# EAGLE design thingSocketv0.1 (EAGLE 7.4.0)
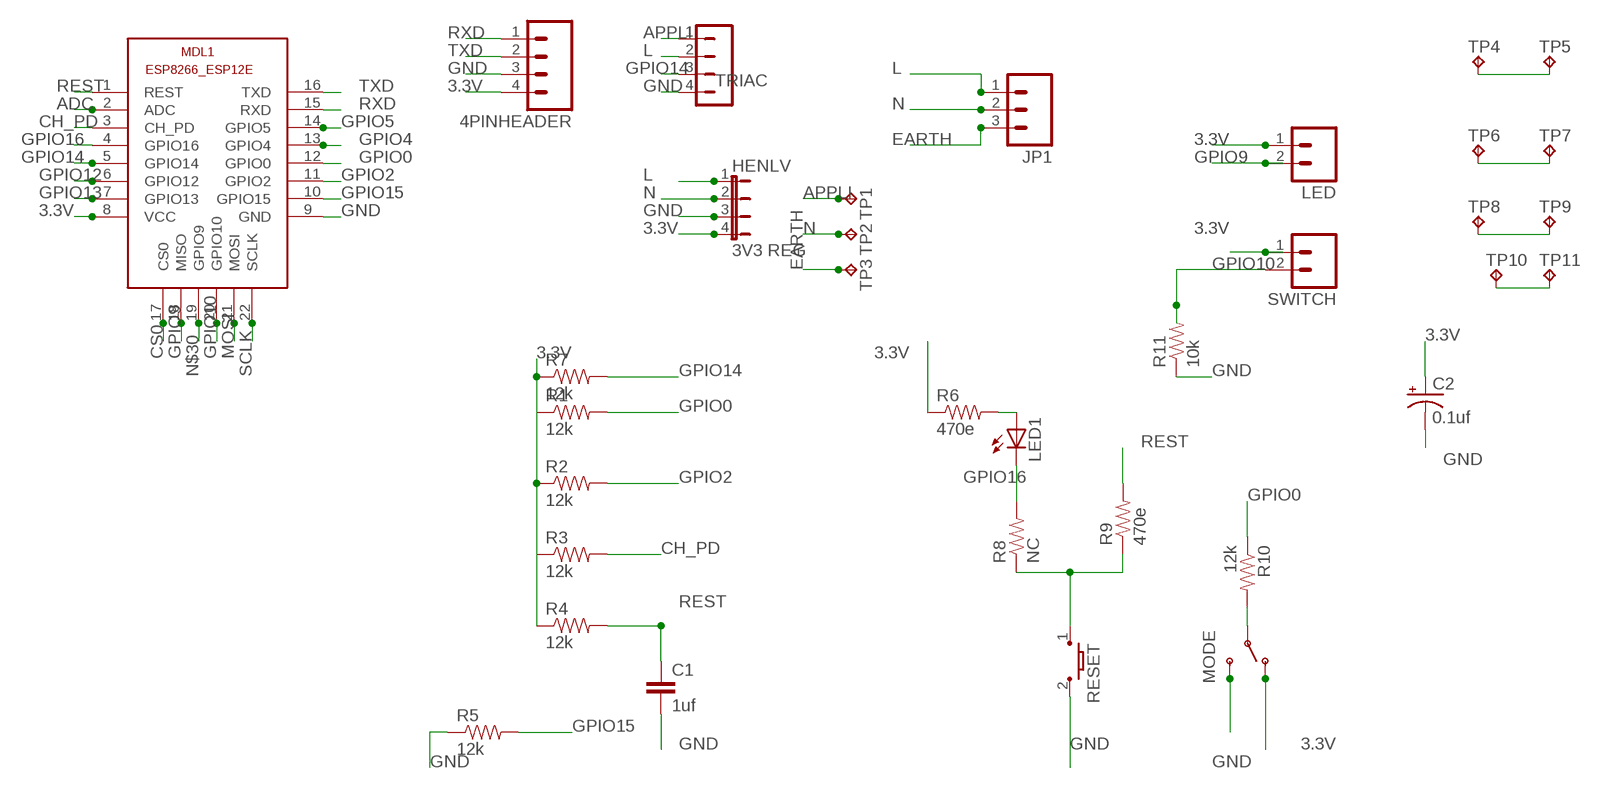
[diagram p0: schematic, sheet 1]

## Parts
4PINHEADER  M04-V  [OUPIIN-4071V-4]
C1  1uf  CAP0603-CAP  [0603-CAP]
C2  0.1uf  CAP_POLSMD  [VISHAY_C]
HENLV  3V3 REG  HENLV3.3  [HENLV3.3PKG]
JP1  M03SCREW  [SCREWTERMINAL-3.5MM-3]
LED  M02  [02P]
LED1  LEDCHIPLED_0805  [CHIPLED_0805]
MDL1  ESP8266-12EESP8266-ESP12E  [ESP8266-ESP12E]
MODE  SWITCH-SPSTSMD2  [SWITCH-SPDT-SMD]
R1  12k  RESISTOR0603-RES  [0603-RES]
R2  12k  RESISTOR0603-RES  [0603-RES]
R3  12k  RESISTOR0603-RES  [0603-RES]
R4  12k  RESISTOR0603-RES  [0603-RES]
R5  12k  RESISTOR0603-RES  [0603-RES]
R6  470e  RESISTOR0603-RES  [0603-RES]
R7  12k  RESISTOR0603-RES  [0603-RES]
R8  NC  RESISTOR0603-RES  [0603-RES]
R9  470e  RESISTOR0603-RES  [0603-RES]
R10  12k  RESISTOR0603-RES  [0603-RES]
R11  10k  RESISTOR0603-RES  [0603-RES]
RESET  TL3302-J  [TL3303_J]
SWITCH  M02  [02P]
TP1  TPPAD1-17  [P1-17]
TP2  TPPAD1-17  [P1-17]
TP3  TPPAD1-17  [P1-17]
TP4  TP-040  [TP-040]
TP5  TP-040  [TP-040]
TP6  TP-040  [TP-040]
TP7  TP-040  [TP-040]
TP8  TP-040  [TP-040]
TP9  TP-040  [TP-040]
TP10  TP-040  [TP-040]
TP11  TP-040  [TP-040]
TRIAC  JP2Q  [JP2Q]

## Nets
3.3V: 4PINHEADER.4 C2.+ HENLV.4 LED.1 MDL1.8(VCC) MODE.1(O) R1.1 R2.1 R3.1 R4.1 R6.1 R7.1 SWITCH.1
ADC: MDL1.2(ADC)
APPLI: TP1.1(TP) TRIAC.1
CH_PD: MDL1.3(CH_PD) R3.2
CS0: MDL1.17(CS0)
EARTH: JP1.3 TP3.1(TP)
GND: 4PINHEADER.3 C1.2 C2.- HENLV.3 MDL1.9(GND) MODE.3(S) R5.1 R11.1 RESET.2 TRIAC.4
GPIO0: MDL1.12(GPIO0) R1.2 R10.1
GPIO2: MDL1.11(GPIO2) R2.2
GPIO4: MDL1.13(GPIO4)
GPIO5: MDL1.14(GPIO5)
GPIO9: LED.2 MDL1.18(MISO)
GPIO10: MDL1.20(GPIO10) R11.2 SWITCH.2
GPIO12: MDL1.6(GPIO12)
GPIO13: MDL1.7(GPIO13)
GPIO14: MDL1.5(GPIO14) R7.2 TRIAC.3
GPIO15: MDL1.10(GPIO15) R5.2
GPIO16: LED1.C MDL1.4(GPIO16) R8.2
L: HENLV.1 JP1.1 TRIAC.2
MOSI: MDL1.21(MOSI)
N: HENLV.2 JP1.2 TP2.1(TP)
N$1: TP4.1 TP5.1
N$2: TP6.1 TP7.1
N$4: R8.1 R9.1 RESET.1
N$6: TP8.1 TP9.1
N$7: TP10.1 TP11.1
N$8: MODE.2(P) R10.2
N$14: LED1.A R6.2
N$30: MDL1.19(GPIO9)
REST: C1.1 MDL1.1(REST) R4.2 R9.2
RXD: 4PINHEADER.1 MDL1.15(RXD)
SCLK: MDL1.22(SCLK)
TXD: 4PINHEADER.2 MDL1.16(TXD)

## Library data of the parts
4PINHEADER = con-oupiin:M04: Oupiin 4071 Series: 4 Pin Male Standard 4-pin 0.1" header. -V: Standard vertical. Supplier: Altronics P5494 -V-LOCK: Vertical with slightly offset pin drills for easier hand soldering (SparkFun trick) Supplier: Altronics P5494 Source: http://www.oupiin.com.tw/pdf/4071-W.pdf
C1 = SparkFun:CAP: Capacitor Standard 0603 ceramic capacitor, and 0.1" leaded capacitor.
C2 = SparkFun-Capacitors:CAP_POL: Capacitor Polarized These are standard SMD and PTH capacitors. Normally 10uF, 47uF, and 100uF in electrolytic and tantalum varieties. Always verify the external diameter of the through hole cap, it varies with capacity, voltage, and manufacturer. The EIA devices should be standard.
HENLV = jumper111:HENLV3.3: JUMPER
JP1 = SparkFun:M03: Header 3 Standard 3-pin 0.1" header. Use with straight break away headers (SKU : PRT-00116), right angle break away headers (PRT-00553), swiss pins (PRT-00743), machine pins (PRT-00117), and female headers (PRT-00115). Molex polarized connector foot print use with SKU : PRT-08232 with associated crimp pins and housings.
LED SWITCH = tango:M02: AMP QUICK CONNECTOR
LED1 = adafruit:LED: LED OSRAM: - CHIPLED LG R971, LG N971, LY N971, LG Q971, LY Q971, LO R971, LY R971 LH N974, LH R974 LS Q976, LO Q976, LY Q976 LO Q996 - Hyper CHIPLED LW Q18S LB Q993, LB Q99A, LB R99A - SideLED LS A670, LO A670, LY A670, LG A670, LP A670 LB A673, LV A673, LT A673, LW A673 LH A674 LY A675 LS A676, LA A676, LO A676, LY A676, LW A676 LS A679, LY A679, LG A679 - Hyper Micro SIDELED® LS Y876, LA Y876, LO Y876, LY Y876 LT Y87S - SmartLED LW L88C, LW L88S LB L89C, LB L89S, LG L890 LS L89K, LO L89K, LY L89K LS L896, LA L896, LO L896, LY L896 - TOPLED LS T670, LO T670, LY T670, LG T670, LP T670 LSG T670, LSP T670, LSY T670, LOP T670, LYG T670 LG T671, LOG T671, LSG T671 LB T673, LV T673, LT T673, LW T673 LH T674 LS T676, LA T676, LO T676, LY T676, LB T676, LH T676, LSB T676, LW T676 LB T67C, LV T67C, LT T67C, LS T67K, LO T67K, LY T67K, LW E67C LS E67B, LA E67B, LO E67B, LY E67B, LB E67C, LV E67C, LT E67C LW T67C LS T679, LY T679, LG T679 LS T770, LO T770, LY T770, LG T770, LP T770 LB T773, LV T773, LT T773, LW T773 LH T774 LS E675, LA E675, LY E675, LS T675 LS T776, LA T776, LO T776, LY T776, LB T776 LHGB T686 LT T68C, LB T68C - Hyper Mini TOPLED® LB M676 - Mini TOPLED Santana® LG M470 LS M47K, LO M47K, LY M47K Source: http://www.osram.convergy.de/
MDL1 = ESP8266-ESP12E:ESP8266-12E: ESP8266-12E with additional I/O and GPIO04/05 corrected The author cannot warrant that this library is free from error or will meet your specific requirements. Created by PuceBaboon.com. Komagane, Nagano, JAPAN
MODE = SparkFun:SWITCH-SPST: SPST Switch Simple slide switch. Spark Fun Electronics SKU : COM-00102
R1-R10 = SparkFun:RESISTOR: Resistor
R11 = SparkFun-Passives:RESISTOR: Resistor
RESET = eswitch-tact:TL3302: E-Switch TL3302 Series Tactile Switch Surface mount button commonly used for reset or general input. 3.5 x 6mm packaged design. -G: Gull wing termination. Parts TL-3302-x-xxxx-x-G -J: J-Lead termination. Parts TL-3302-x-xxxx-x-J Source: http://www.e-switch.com/Portals/0/Series_Pdf/TL3302.pdf Supplier: DigiKey: http://be.digikey.com/scripts/dksearch/dksus.dll?vendor=0&keywords=TL3302
TP1-TP3 = testpad:TP: Test pad
TP4-TP11 = keystone:TP: TEST POINT PCB Vertical Mount
TRIAC = pwm-base:JP2Q: JUMPER

## Net classes
0 default: width 0.254 mm, drill 0.2 mm, clearance 0.254 mm
1 pwr: width 0.508 mm, drill 0.2 mm, clearance 0.205 mm to class 0, clearance 0.254 mm

## Board
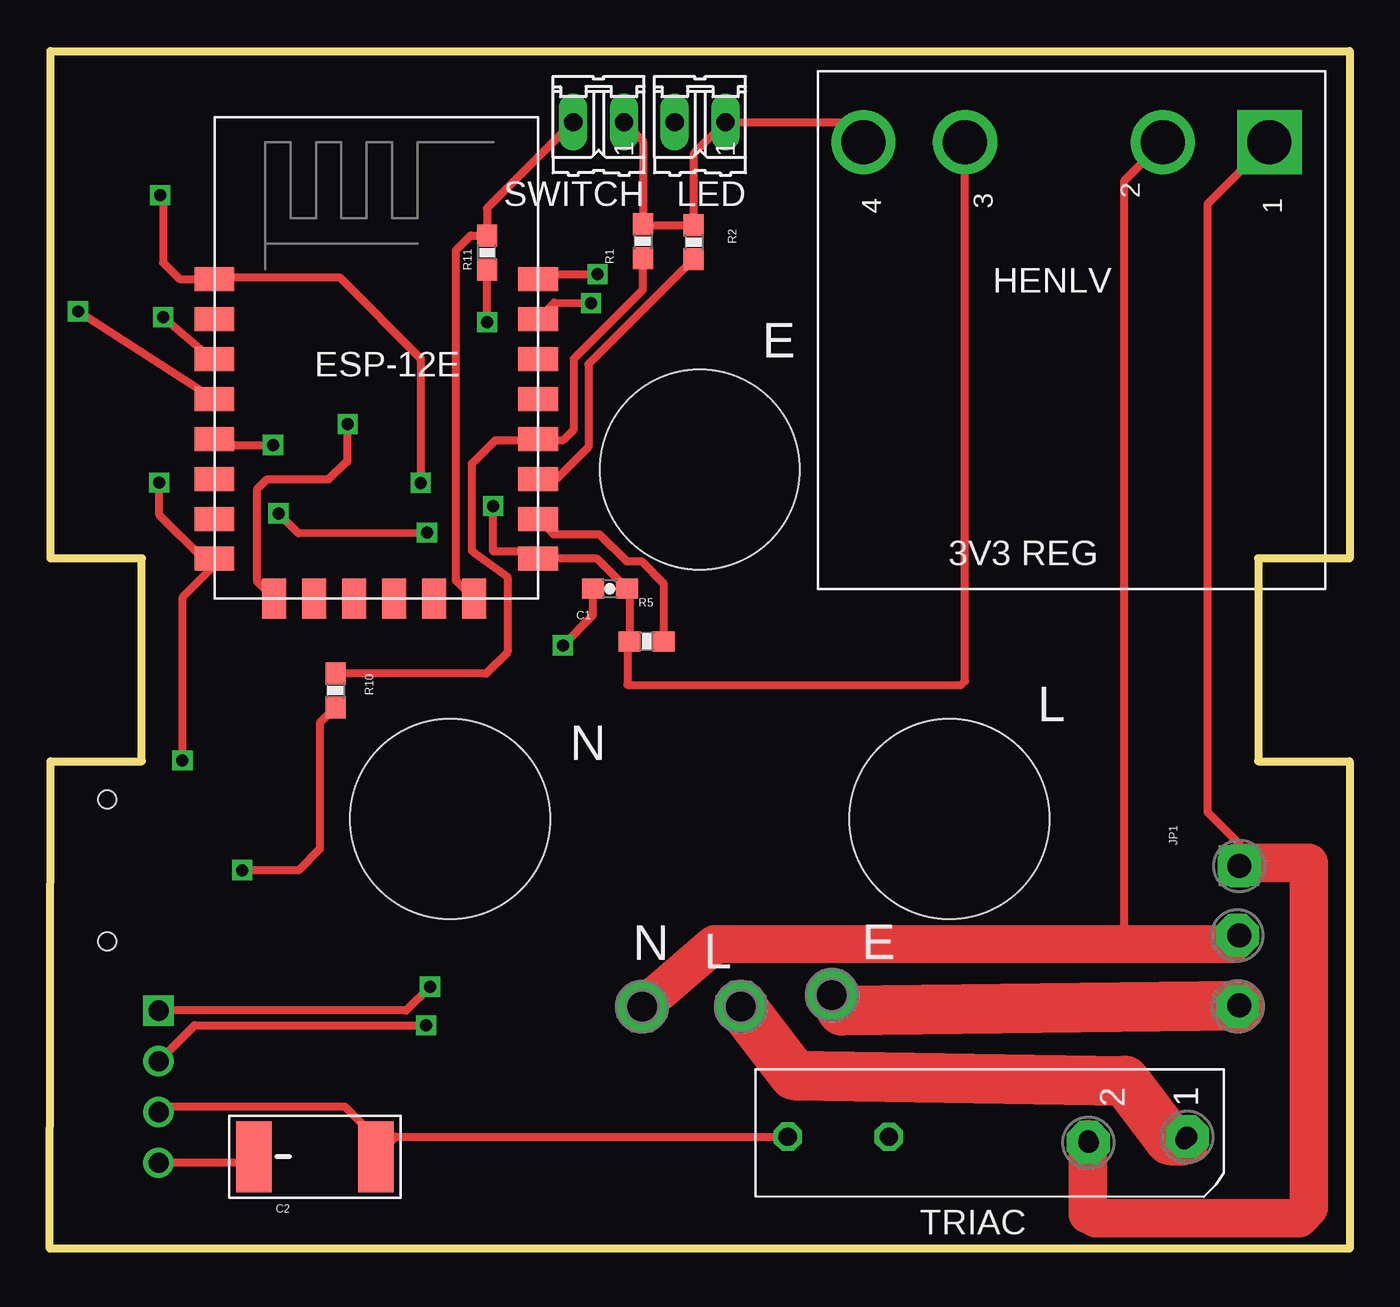
[diagram p1: board, top side]
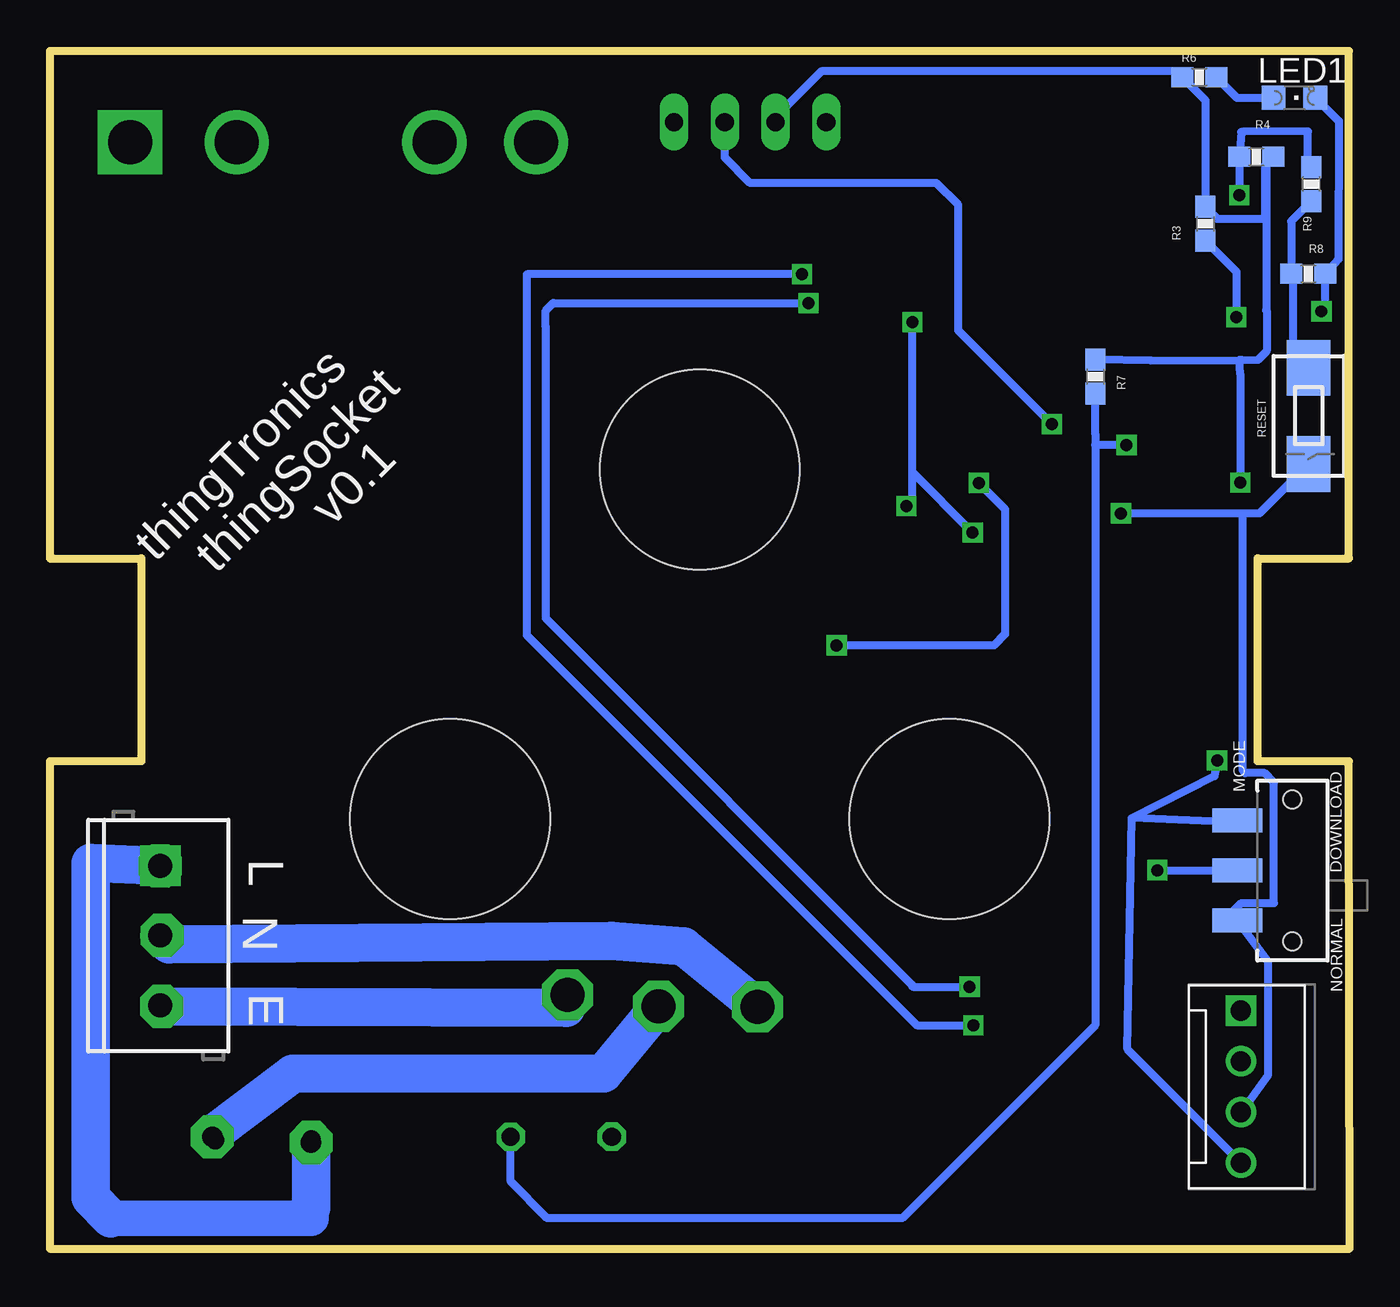
[diagram p2: board, bottom side, seen from below]

Size 65.06 x 60 mm. Coordinates in mm from the lower left corner, seen from the top.
Outline: 0,0 65.03,0
Outline: 65.03,60 0.03,60 0.03,59.94
Outline: 0,0 0.03,24.38 4.6,24.38 4.6,34.54 0.03,34.54 0.03,59.94
Outline: 0.03,59.94 65.06,59.94 65.06,34.54 60.48,34.54 60.48,24.38 65.06,24.38 65.06,0 0,0
Copper layers (1*16): Top 0.035mm / dielectric 1.5mm / Bottom 0.035mm
Design rules "esp": minimum track width 10mil, minimum drill 24mil, track to track 0.205mm, track to pad 0.205mm, pad to pad 0.205mm, via to via 0.205mm, smd to smd 8mil, copper to edge 40mil, drill to drill 8mil, minimum pad ring 10mil, minimum via ring 8mil, stop-mask expansion 4mil, vias tented up to drill 0mil, thermal gap 10mil
Holes 10 mm at 32.53,39 20.03,21.5 45.03,21.5

### Footprints (pad centres in the part's own frame; a part is rotated, then mirrored left to right if it is on the bottom)
OUPIIN-4071V-4 = drill 1.016 square: 1 0,0 | drill 1.016: 2 2.54,0; 3 5.08,0; 4 7.62,0
0603-CAP = smd 1.1 x 1: 1 -0.85,0; 2 0.85,0
VISHAY_C = smd 3.556 x 1.778: + 0,3.048; - 0,-3.048
HENLV3.3PKG = drill 2.2 square: 1 17.272,-17.78 | drill 2.2: 2 17.272,-12.446; 3 17.272,-2.54; 4 17.272,2.54
SCREWTERMINAL-3.5MM-3 = drill 1.2 pad 2.032 square: 1 0,0 | drill 1.2 pad 2.032: 2 3.5,0; 3 7,0
02P = drill 0.914 long: 1 -1.27,0; 2 1.27,0
CHIPLED_0805 = smd 1.2 x 1.2: A 0,-1.05; C 0,1.05
ESP8266-ESP12E = smd 2 x 1.2: 1 0,16; 2 0,14; 3 0,12; 4 0,10; 5 0,8; 6 0,6; 7 0,4; 8 0,2; 9 16.2,2; 10 16.2,4; 11 16.2,6; 12 16.2,8; 13 16.2,10; 14 16.2,12; 15 16.2,14; 16 16.2,16 | smd 1.2 x 2: 17 11,0; 18 3,0; 19 5,0; 20 13,0; 21 7,0; 22 9,0
SWITCH-SPDT-SMD = smd 1.2 x 2.5: 1 -2.5,-2.75; 2 0,-2.75; 3 2.5,-2.75 | hole 0.9: -3.55,0; 3.55,0
0603-RES = smd 1.1 x 1: 1 -0.85,0; 2 0.85,0
TL3303_J = smd 2.794 x 2.159: 1 -2.413,0; 2 2.413,0
P1-17 = drill 1.702 pad 2.54 octagon: 1 0,0
TP-040 = drill 1.016 pad 2.159 octagon: 1 0,0
JP2Q = drill 0.914 octagon: 1 -1.27,-1.27; 2 -1.24,3.552; 3 -1.105,13.519; 4 -1.104,18.587

### Placement (x,y rotation side)
4PINHEADER  5.44,11.91 270 bottom
C1  28.04,33.03 0 top
C2  13.26,4.6 90 top
DRILEGEND  [DRILEGEND]  -0.95,-4.01 0 top  (outside the outline)
HENLV  43.27,38.11 90 top
JP1  59.53,19.17 270 bottom
LED  32.54,56.39 180 top
LED1  2.76,57.6 270 bottom
MDL1  8.23,32.53 0 top
MODE  2.86,18.92 270 bottom
R1  29.68,50.42 270 top
R2  32.22,50.38 270 top
R3  7.21,51.3 270 bottom
R4  4.67,54.65 180 bottom
R5  29.87,30.39 0 top
R6  7.52,58.63 0 bottom
R7  12.73,43.64 270 bottom
R8  2.07,48.79 0 bottom
R9  1.91,53.29 90 bottom
R10  14.29,27.93 270 top
R11  21.88,49.86 90 top
RESET  2.05,41.67 270 bottom
SWITCH  27.46,56.39 180 top
TP1  34.59,12.12 0 top
TP2  29.64,12.1 0 top
TP3  39.14,12.69 0 top
TP4  34.58,12.11 0 top
TP5  56.93,5.59 0 top
TP6  29.64,12.11 0 top
TP7  59.43,15.67 0 top
TP8  39.15,12.7 0 top
TP9  59.46,12.12 0 top
TP10  59.53,19.15 0 top
TP11  51.99,5.31 0 top
TRIAC  55.51,6.7 90 top

### Tracks (layer width: path | path; a pad name or v marks a point on that pad's centre or on a via)
3.3V  (via drill 0.6)
  Top 0.406: C2.+ 9.9,4.29 4PINHEADER.4 | SWITCH.1 29.68,55.44 R1.1 29.72,51.23 R2.1 32.22,54.8 LED.1 40.16,56.39 40.73,55.83 HENLV.4 | v6.63,24.44 6.63,32.59 8.57,34.53 MDL1.8 7.67,34.53 5.48,36.72 v5.48,38.34
  Bottom 0.406: v6.63,24.44 6.76,23.66 10.91,21.55 | 4PINHEADER.4 11.12,9.97 10.91,21.55 | MODE.1 5.7,21.34 10.91,21.55 | SWITCH.1 28.73,56.64 26.45,58.93 8.67,58.93 R6.1 7.21,57.47 R3.1 6.62,51.55 4.23,51.54 4.23,54.25 4.17,54.31 | 5.52,44.48 9.96,44.45 R7.1 | 5.52,44.48 5.42,44.48 4.57,44.49 4.15,44.91 4.15,46.95 4.17,46.97 4.17,54.31 | R4.1 4.13,54.36 4.17,54.31 | v5.48,38.34 5.48,43.8 5.52,44.48
APPLI
  Top 2.5: TP1.1 37.25,8.68 53.8,8.4 56.07,5.43 TRIAC.1
CH_PD  (via drill 0.6)
  Top 0.406: 7.79,44.53 MDL1.3 8.21,44.47 v5.66,46.63
  Bottom 0.406: R3.2 5.66,48.89 v5.66,46.63
EARTH
  Top 2.5: TP3.1 39.66,11.91 JP1.3
GND  (via drill 0.6, 0.6 pad 1.02)
  Top 0.305: 22.19,35.58 v22.19,37.16
  Top 0.406: MDL1.9 24.67,34.29 | TRIAC.4 17.3,5.59 C2.- 16.3,5.57 14.76,7.11 5.72,7.11 4PINHEADER.3 | MDL1.9 27.39,34.53 C1.2 29.02,32.89 R5.1 28.73,30.1 28.9,29.93 28.9,28.22 45.62,28.22 45.81,28.41 HENLV.3 | v11.44,36.8 12.43,35.81 v18.87,35.84 | v21.88,46.38 21.88,46.39 R11.1 | MDL1.9 23.82,34.89 22.19,34.89 v22.19,37.16
  Bottom 0.406: 4PINHEADER.3 5.39,6.83 4.1,8.64 4.1,14.4 MODE.3 6.29,16.42 5.42,17.3 3.78,17.3 3.78,23.33 4.26,23.8 5.23,23.8 5.33,23.91 5.33,36.8 | RESET.2 4.51,36.8 5.33,36.8 | 5.33,36.8 v11.44,36.8 | 21.88,38.86 v21.88,46.38 | v18.87,35.84 21.88,38.86 | v22.19,37.16 21.88,37.35 21.88,38.86
GPIO0
  Top 0.406: R10.1 21.84,28.78 22.9,29.84 22.9,33.62 21.29,34.78 21.13,34.94 21.13,39.3 22.29,40.46 24.12,40.46 24.24,40.34 MDL1.12 24.48,40.48 25.71,40.48 26.23,41 26.23,44.54 29.68,48 R1.2
GPIO2
  Top 0.406: MDL1.11 25.35,38.53 26.96,40.13 26.96,44.27 R2.2
GPIO9  (via drill 0.6)
  Top 0.406: MDL1.18 10.38,33.38 10.38,38.02 10.87,38.51 13.96,38.51 14.85,39.39 14.89,39.39 v14.89,41.26
  Bottom 0.406: LED.2 31.27,54.61 30,53.34 20.68,53.34 19.59,52.24 19.59,45.96 v14.89,41.26
GPIO10
  Top 0.406: SWITCH.2 21.88,52.07 R11.2 21.06,50.7 20.33,49.97 20.33,33.44 MDL1.20
GPIO14  (via drill 0.6)
  Top 0.406: MDL1.5 8.63,40.13 8.73,40.23 v11.16,40.23
  Bottom 0.406: TRIAC.3 41.99,3.35 40.16,1.52 22.38,1.52 12.73,11.18 12.73,40.23 | 12.73,40.23 12.73,40.81 R7.2 | v11.16,40.23 12.73,40.23
GPIO15
  Top 0.406: MDL1.10 25.2,35.76 27.5,35.76 28.85,34.41 29.61,34.41 30.72,33.29 R5.2
GPIO16  (via drill 0.6 pad 1.02)
  Top 0.406: 7.7,42.53 MDL1.4 v1.4,46.91
  Bottom 0.406: LED1.C 0.54,56.44 0.56,49.52 R8.2 1.22,47.1 v1.4,46.91
L
  Top 0.406: JP1.1 59.53,20.26 57.94,21.84 57.94,52.27 HENLV.1 | 51.66,1.72 51.96,1.72 52.36,1.72 52.36,1.52
  Top 1.93: JP1.1 59.67,19.3 63.02,19.3 63.02,2.03 62.52,1.52 52.36,1.52 | 51.96,1.72 TRIAC.2
N
  Top 0.406: HENLV.2 53.76,53.43 53.76,15.22 54.21,15.66 JP1.2
  Bottom 1.93: JP1.2 59.08,15.22 36.94,15.39 33.33,15.12 TP2.1
N$1
  Bottom 1.93: TP4.1 37.35,8.78 52.9,8.74 57.06,5.63 TP5.1
N$2
  Top 1.93: TP6.1 33.26,15.23 59.16,15.25 59.47,15.56 TP7.1
N$4
  Bottom 0.406: R9.1 2.92,51.42 R8.1 2.83,48.71 2.83,44.44 2.48,44.09 RESET.1
N$6
  Bottom 1.93: TP8.1 39.22,12.04 TP9.1
N$7
  Bottom 1.778: 62.01,1.52 51.99,1.52 51.99,3.02
  Bottom 1.93: TP10.1 63.02,19.3 63.02,2.54 62.01,1.52 | 51.99,2.03 51.99,3.02 TP11.1
N$8  (via drill 0.6 pad 1.02)
  Top 0.406: R10.2 13.51,26.3 13.51,20 12.45,18.93 v9.62,18.93
  Bottom 0.406: v9.62,18.93 9.61,18.92 MODE.2
N$14
  Bottom 0.406: R6.2 5.64,57.6 LED1.A
REST  (via drill 0.6 pad 1.02)
  Top 0.406: MDL1.1 7.56,48.5 | v18.56,38.33 18.56,44.56 14.5,48.62 8.32,48.62 MDL1.1 | v25.68,30.2 27.19,31.7 C1.1 | v5.52,52.73 5.67,52.58 5.67,49.34 6.49,48.53 MDL1.1
  Bottom 0.406: R9.2 2.09,54.32 2.09,55.93 5.36,55.9 5.43,55.89 R4.2 v5.52,52.73 | v18.56,38.33 17.25,37.01 17.25,30.75 17.8,30.2 v25.68,30.2
RXD  (via drill 0.6 pad 1.02)
  Top 0.406: MDL1.15 25.26,47.35 v27.08,47.33 | v19.02,13.11 17.83,11.91 4PINHEADER.1
  Bottom 0.406: v19.02,13.11 21.86,13.11 21.9,13.14 21.9,13.2 40.23,31.54 40.23,46.12 40.25,46.13 40.25,46.94 39.86,47.33 v27.08,47.33
TXD  (via drill 0.6)
  Top 0.406: MDL1.16 24.43,48.77 v27.41,48.78 | 4PINHEADER.2 7.24,11.18 v18.83,11.18
  Bottom 0.406: v27.41,48.78 41.18,48.77 41.18,30.7 21.66,11.18 v18.83,11.18

### Text on the board
tNames: E | L | N | N | L | E
bNames: v0.1 | thingSocket | thingTronics | DOWNLOAD | L | NORMAL | N | E